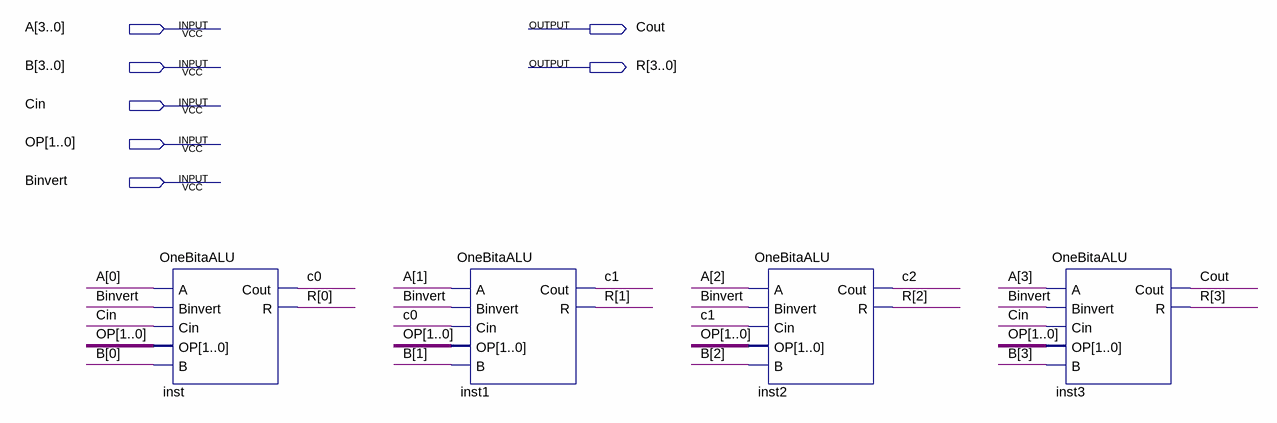
[diagram p0: schematic sheet]
// Quartus schematic FourBitALU.bdf as structural Verilog: 4 symbols, 7 pins
module FourBitALU (
  input  [3:0] A,
  input  [3:0] B,
  input  Cin,
  input  [1:0] OP,
  input  Binvert,
  output Cout,
  output [3:0] R
);

  wire c0, c1, c2;

  OneBitaALU inst (.A(A[0]), .Binvert(Binvert), .Cin(Cin), .OP(OP), .B(B[0]), .Cout(c0), .R(R[0]));
  OneBitaALU inst1 (.A(A[1]), .Binvert(Binvert), .Cin(c0), .OP(OP), .B(B[1]), .Cout(c1), .R(R[1]));
  OneBitaALU inst2 (.A(A[2]), .Binvert(Binvert), .Cin(c1), .OP(OP), .B(B[2]), .Cout(c2), .R(R[2]));
  OneBitaALU inst3 (.A(A[3]), .Binvert(Binvert), .Cin(Cin), .OP(OP), .B(B[3]), .Cout(Cout), .R(R[3]));
endmodule
